# EAGLE design esquema (EAGLE 8.6.3)
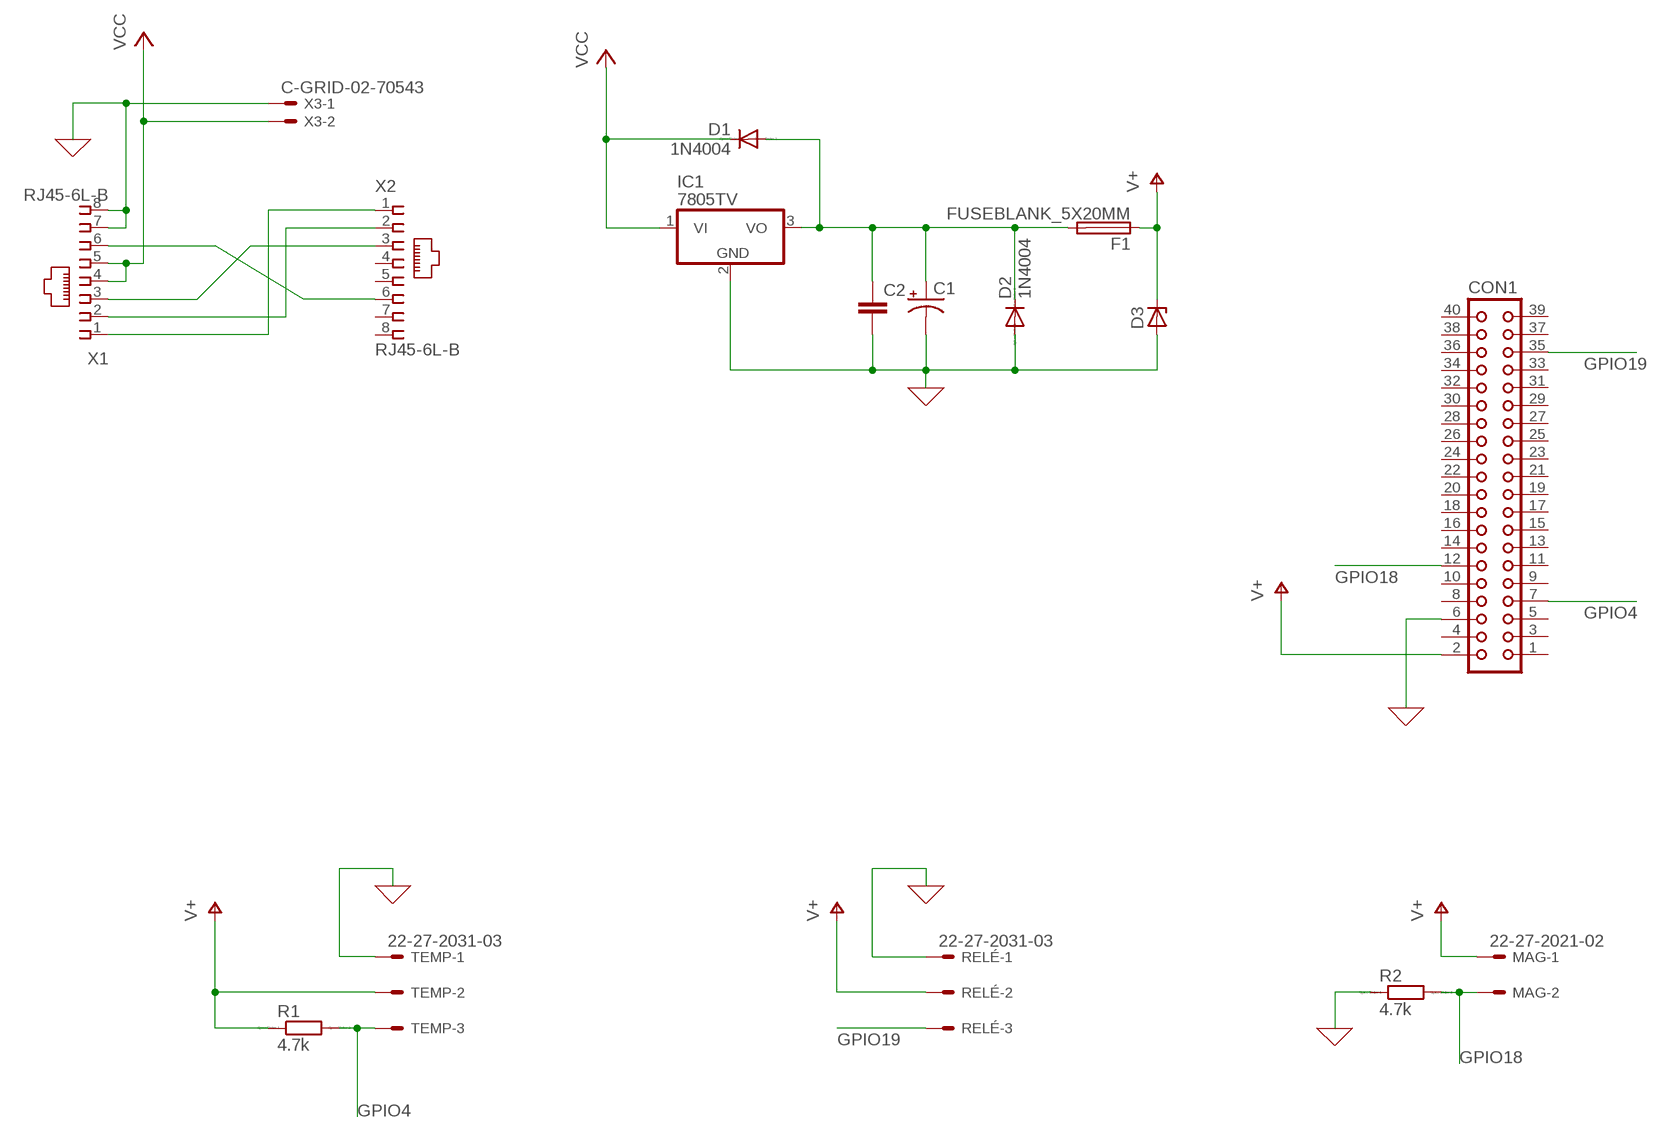
[diagram p0: schematic, sheet 1]

## Parts
C1  CPOL-USE5-8.5  [E5-8,5]
C2  C-EU025-030X050  [C025-030X050]
CON1  CON40  [CON40]
D1  1N4004  [DO41-10]
D2  1N4004  [DO41-10]
D3  ZENER-DIODEDO35Z10  [DO35Z10]
F1  FUSEBLANK_5X20MM  [FUSE_HOLDER_5X20MM]
IC1  7805TV  [TO220V]
MAG  22-27-2021-02  [6410-02]
R1  4.7k  R0204/7  [0204/7]
R2  4.7k  R0204/7  [0204/7]
RELÉ  22-27-2031-03  [6410-03]
TEMP  22-27-2031-03  [6410-03]
X1  RJ45-6L-B  [RJ45-NO-SHIELD]
X2  RJ45-6L-B  [RJ45-NO-SHIELD]
X3  C-GRID-02-70543  [70543-02]

## Nets
0: C1.- C2.2 CON1.6 D2.A D3.A IC1.2(GND) R2.1 RELÉ.1 TEMP.1 X1.7 X1.8 X3.1 ; supply symbol labelled GND
GPIO4: CON1.7 R1.2 TEMP.3
GPIO18: CON1.12 MAG.2 R2.2
GPIO19: CON1.35 RELÉ.3
N$1: X1.6 X2.6
N$2: C1.+ C2.1 D1.A D2.C F1.2 IC1.3(VO)
N$9: X1.3 X2.3
N$11: X1.2 X2.2
N$12: X1.1 X2.1
V+: CON1.2 D3.C F1.1 MAG.1 R1.1 RELÉ.2 TEMP.2
VCC: D1.C IC1.1(VI) X1.4 X1.5 X3.2
Unconnected: CON1.1 CON1.3 CON1.4 CON1.5 CON1.8 CON1.9 CON1.10 CON1.11 CON1.13 CON1.14 CON1.15 CON1.16 CON1.17 CON1.18 CON1.19 CON1.20 CON1.21 CON1.22 CON1.23 CON1.24 CON1.25 CON1.26 CON1.27 CON1.28 CON1.29 CON1.30 CON1.31 CON1.32 CON1.33 CON1.34 CON1.36 CON1.37 CON1.38 CON1.39 CON1.40 X2.4 X2.5 X2.7 X2.8

## Library data of the parts
C1 = rcl:CPOL-US: POLARIZED CAPACITOR, American symbol; SPICEPREFIX: C
C2 = rcl:C-EU: CAPACITOR, European symbol; SPICEPREFIX: C
CON1 = con-harting:CON40: CONNECTOR; OC_FARNELL: unknown; OC_NEWARK: unknown
D1 D2 = diode:1N4004: DIODE general purpose rectifier, 1 A
D3 = diode:ZENER-DIODE: Z-Diode
F1 = fuse:FUSE: Fuse; OC_FARNELL: unknown; OC_NEWARK: unknown
IC1 = linear:78*: Positive VOLTAGE REGULATOR Source: http://cache.national.com/ds/LM/LM78L05.pdf http://www.fairchildsemi.com/ds/LM/LM7805.pdf
MAG = con-molex:22-?-02: CONNECTOR wire to board 2.54 mm (.1 inch) pitch header; MF: MOLEX; OC_FARNELL: unknown; OC_NEWARK: unknown
R1 R2 = eagle-ltspice:R: RESISTOR, European symbol; SPICEMODEL: NONE; SPICEPREFIX: R
RELÉ TEMP = con-molex:22-?-03: CONNECTOR wire to board 2.54 mm (.1 inch) pitch header; MF: MOLEX; OC_FARNELL: unknown; OC_NEWARK: unknown
X1 X2 = con-tycoelectronics:RJ45: CORCOM Modular RJ Jacks No Shield Source: www.tycoelectronics.com .. ENG_DS_1654001_1099_RJ_L_0507.pdf; MPN: RJ45-6L-B; OC_FARNELL: unknown; OC_NEWARK: 16R6090
X3 = con-molex:C-GRID-02: CONNECTOR wire to board 2.54 mm (0.100") pitch header; MF: MOLEX; OC_FARNELL: unknown; OC_NEWARK: unknown

## Board
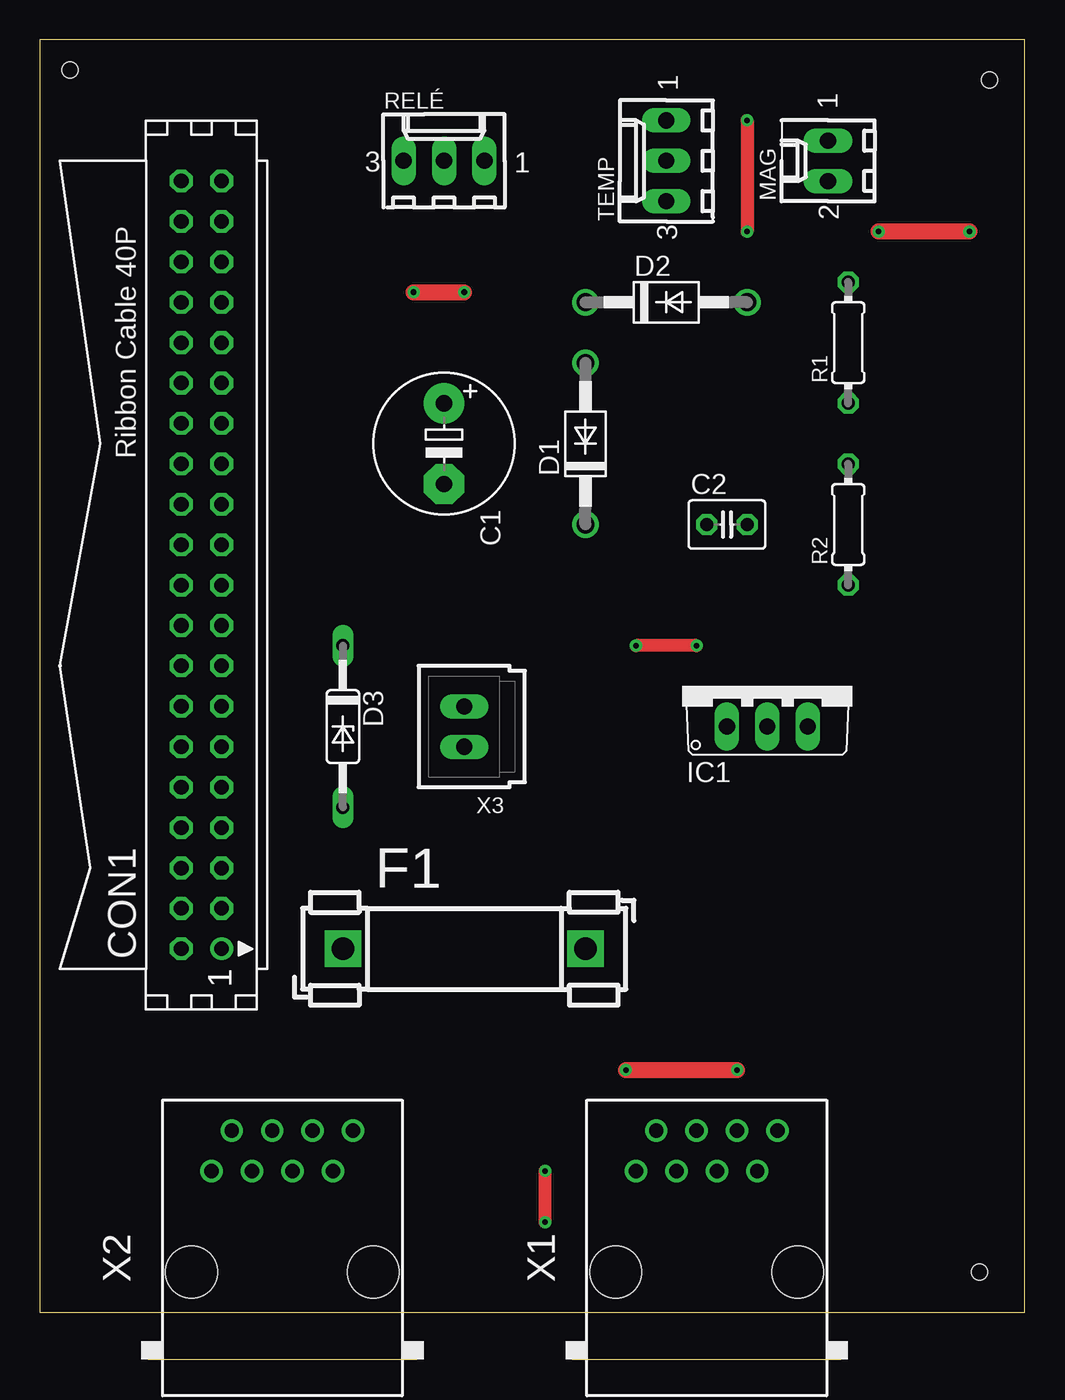
[diagram p1: board, top side]
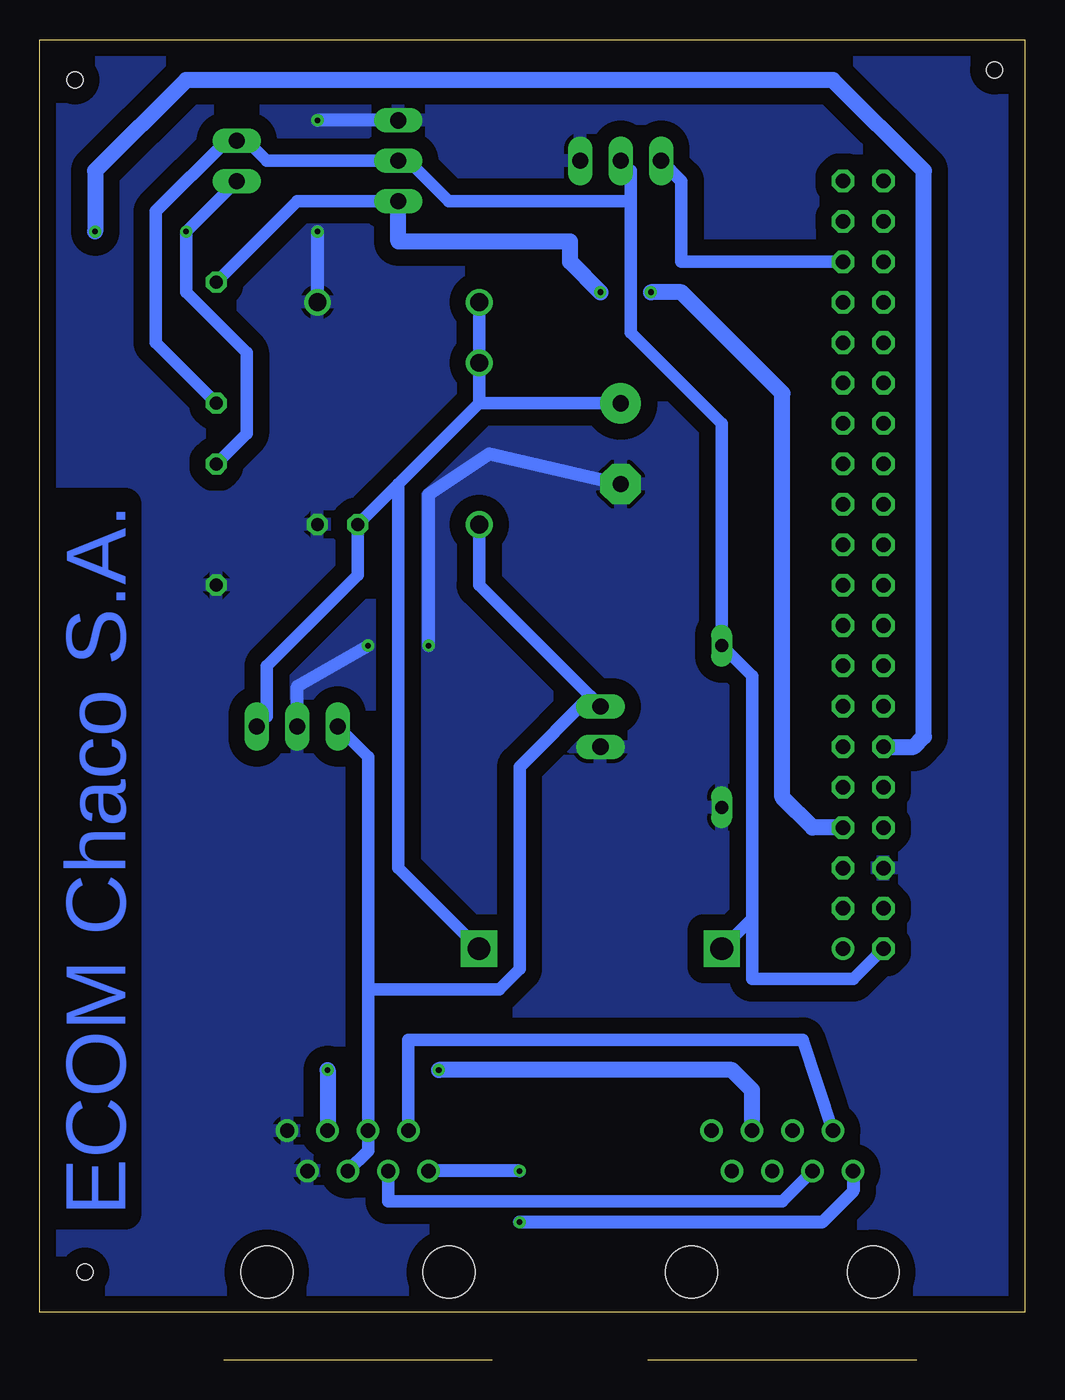
[diagram p2: board, bottom side, seen from below]

Size 61.9 x 80 mm. Coordinates in mm from the lower left corner, seen from the top.
Outline: 0,0 61.9,0 61.9,80 0,80 0,0
Copper layers (1*16): Top 0.035mm / dielectric 1.5mm / Bottom 0.035mm
Design rules "default *": minimum track width 0.8mm, minimum drill 0.8mm, track to track 0.5mm, track to pad 0.5mm, pad to pad 0.5mm, via to via 0.5mm, smd to smd 0.5mm, copper to edge 1mm, drill to drill 1mm, minimum pad ring 10mil, minimum via ring 8mil, stop-mask expansion 4mil, vias tented up to drill 0mil, thermal gap 10mil
Holes 1 mm at 1.91,78.11 59.69,77.47 59.05,2.54

### Footprints (pad centres in the part's own frame; a part is rotated, then mirrored left to right if it is on the bottom)
E5-8,5 = drill 1.016 pad 2.54: + -2.54,0 | drill 1.016 pad 2.54 octagon: - 2.54,0
C025-030X050 = drill 0.813 octagon: 1 -1.27,0; 2 1.27,0
CON40 = drill 0.914: 1 -24.13,-1.27 | drill 0.914 octagon: 2 -24.13,1.27; 3 -21.59,-1.27; 4 -21.59,1.27; 5 -19.05,-1.27; 6 -19.05,1.27; 7 -16.51,-1.27; 8 -16.51,1.27; 9 -13.97,-1.27; 10 -13.97,1.27; 11 -11.43,-1.27; 12 -11.43,1.27; 13 -8.89,-1.27; 14 -8.89,1.27; 15 -6.35,-1.27; 16 -6.35,1.27; 17 -3.81,-1.27; 18 -3.81,1.27; 19 -1.27,-1.27; 20 -1.27,1.27; 21 1.27,-1.27; 22 1.27,1.27; 23 3.81,-1.27; 24 3.81,1.27; 25 6.35,-1.27; 26 6.35,1.27; 27 8.89,-1.27; 28 8.89,1.27; 29 11.43,-1.27; 30 11.43,1.27; 31 13.97,-1.27; 32 13.97,1.27; 33 16.51,-1.27; 34 16.51,1.27; 35 19.05,-1.27; 36 19.05,1.27; 37 21.59,-1.27; 38 21.59,1.27; 39 24.13,-1.27; 40 24.13,1.27
DO41-10 = drill 1.118: A 5.08,0; C -5.08,0
DO35Z10 = drill 0.813 long: A 5.08,0; C -5.08,0
FUSE_HOLDER_5X20MM = drill 1.422 pad 2.286 square: 1 0,0; 2 15.24,0
TO220V = drill 1.016 long: 1 -2.54,-2.54; 2 0,-2.54; 3 2.54,-2.54
6410-02 = drill 1.016 long: 1 1.27,0; 2 -1.27,0
0204/7 = drill 0.813 octagon: 1 -3.81,0; 2 3.81,0
6410-03 = drill 1.016 long: 1 2.54,0; 2 0,0; 3 -2.54,0
RJ45-NO-SHIELD = drill 0.9 pad 1.4: 1 -4.445,6.35; 2 -3.175,8.89; 3 -1.905,6.35; 4 -0.635,8.89; 5 0.635,6.35; 6 1.905,8.89; 7 3.175,6.35; 8 4.445,8.89 | hole 3.251: -5.715,0; 5.715,0
70543-02 = drill 1.016 long: 1 -1.27,0; 2 1.27,0

### Placement (x,y rotation side)
C1  25.4,54.61 270 top
C2  43.18,49.53 0 top
CON1  10.16,46.99 90 top
D1  34.29,54.61 90 top
D2  39.37,63.5 0 top
D3  19.05,36.83 270 top
F1  19.05,22.86 0 top
IC1  45.72,39.37 0 top
MAG  49.53,72.39 90 top
R1  50.8,60.96 90 top
R2  50.8,49.53 90 top
RELÉ  25.4,72.39 0 top
TEMP  39.37,72.39 90 top
X1  41.91,2.54 0 top
X2  15.24,2.54 0 top
X3  26.67,36.83 90 top

### Tracks (layer width: path | path; a pad name or v marks a point on that pad's centre or on a via)
0  (via drill 0.35)
  Top 0.813: v41.27,41.91 v37.47,41.91 | v44.45,74.93 v44.45,67.94
  Bottom 0.813: IC1.2 45.72,39.37 v41.27,41.91 | v37.47,41.91 37.47,51.44 33.66,53.98 C1.- | TEMP.1 v44.45,74.93 | v44.45,67.94 D2.A
  pour Bottom (isolate 1.016): 0.64,79.38 60.96,79.38 60.96,0.64 0.64,0.64
GPIO4  (via drill 0.35)
  Top 1.016: v23.5,64.14 v26.67,64.14
  Bottom 0.8: R1.2 45.72,69.85 TEMP.3
  Bottom 1.016: CON1.7 13.34,30.48 15.24,32.38 15.24,57.78 21.59,64.14 v23.5,64.14 | v26.67,64.14 28.57,66.04 28.57,67.31 39.37,67.31 TEMP.3
GPIO18  (via drill 0.35)
  Top 1.016: v58.42,67.94 v52.7,67.94
  Bottom 0.8: R2.2 48.9,55.24 48.9,60.33 52.7,64.14 v52.7,67.94 MAG.2
  Bottom 1.016: CON1.12 6.99,35.56 6.35,36.2 6.35,71.75 12.06,77.47 52.7,77.47 58.42,71.75 v58.42,67.94
GPIO19
  Bottom 0.8: CON1.35 21.59,66.04 21.59,71.12 RELÉ.3
N$1  (via drill 0.35)
  Top 1.016: v36.83,15.24 v43.81,15.24
  Bottom 1.016: X2.6 17.14,13.97 18.41,15.24 v36.83,15.24 | v43.81,15.24 X1.6
N$2
  Bottom 0.8: 34.29,57.15 39.37,52.07 | 39.37,52.07 C2.1 41.91,46.35 47.62,40.64 47.62,37.47 IC1.3 | 34.29,57.15 D1.A D2.C | F1.2 39.37,27.94 39.37,52.07 | 34.29,57.15 C1.+
N$9
  Bottom 0.8: X2.3 15.24,6.99 40.01,6.99 X1.3
N$11
  Bottom 0.8: X2.2 13.97,17.14 38.73,17.14 X1.2
N$12  (via drill 0.35)
  Top 0.813: v31.75,5.68 v31.75,8.89
  Bottom 0.813: X2.1 10.79,7.62 12.74,5.68 v31.75,5.68 | v31.75,8.89 X1.1
V+
  Bottom 0.8: R1.1 54.61,60.96 54.61,69.22 50.16,73.66 MAG.1 48.9,73.66 47.62,72.39 TEMP.2 38.73,72.39 36.2,69.85 24.77,69.85 | 17.14,24.77 17.14,40.01 D3.C 19.05,55.88 24.77,61.59 24.77,69.85 | F1.1 17.14,24.77 | CON1.2 10.79,20.95 17.14,20.95 17.14,24.77 | RELÉ.2 24.77,71.75 24.77,69.85
VCC
  Bottom 0.8: 27.3,38.73 34.29,45.72 D1.C | X1.5 41.27,10.16 X1.4 41.27,20.32 | IC1.1 41.27,34.92 41.27,20.32 | 27.3,38.73 31.75,34.29 31.75,21.59 33.02,20.32 41.27,20.32 | 27.3,38.73 X3.2

### Text on the board
Bottom: ECOM Chaco S.A.